# Altium schematic sheet [01]-ESP32.SchDoc
size A3; SheetNumber: 1; SheetTotal: 1
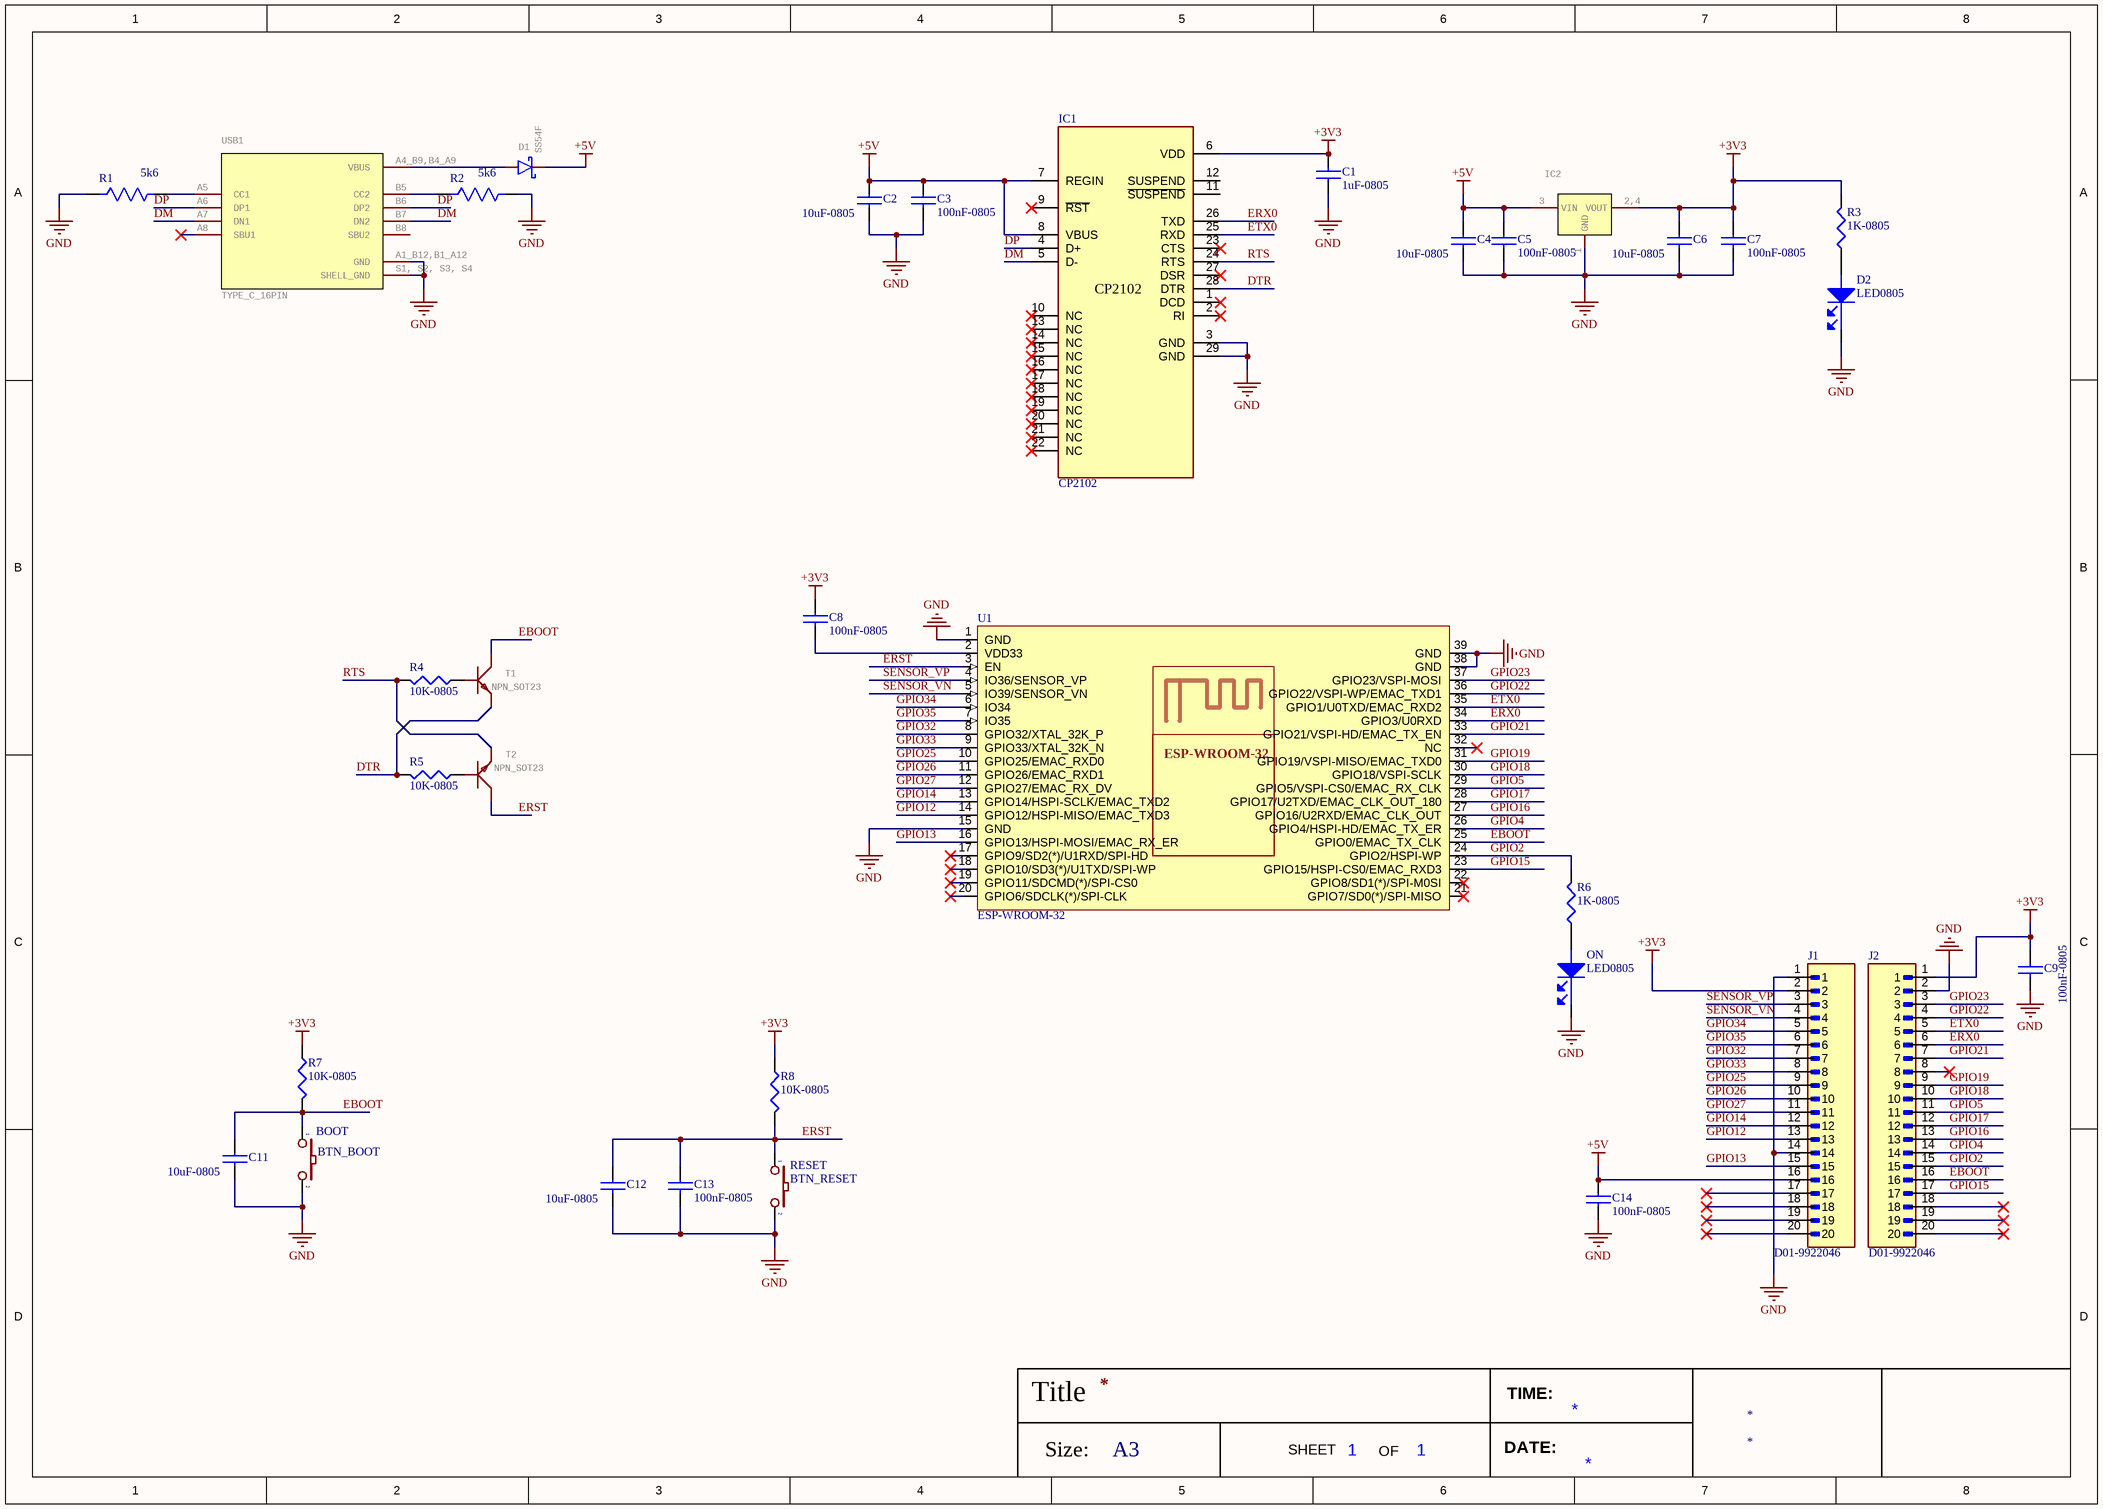
[diagram p0: [01]-ESP32.SchDoc]

## Parts
BOOT  BTN_BOOT  [Button 3x4mm]
C1  1uF-0805  [CAP0805]
C2  10uF-0805  [CAP0805]
C3  100nF-0805  [CAP0805]
C4  10uF-0805  [CAP0805]
C5  100nF-0805  [CAP0805]
C6  10uF-0805  [CAP0805]
C7  100nF-0805  [CAP0805]
C8  100nF-0805  [CAP0805]
C9  100nF-0805  [CAP0805]
C11  10uF-0805  [CAP0805]
C12  10uF-0805  [CAP0805]
C13  100nF-0805  [CAP0805]
C14  100nF-0805  [CAP0805]
D1  SS54F  [SMAF]
D2  LED0805  [LED0805]
IC1  CP2102  [QFN-28]
IC2  LD1117  [SOT223]  (value not drawn)
J1  D01-9922046  [HARWIN_D01-9922046]
J2  D01-9922046  [HARWIN_D01-9922046]
ON  LED0805  [LED0805]
R1  5k6  [R0805]
R2  5k6  [R0805]
R3  1K-0805  [RES0805]
R4  10K-0805  [RES0805]
R5  10K-0805  [RES0805]
R6  1K-0805  [RES0805]
R7  10K-0805  [RES0805]
R8  10K-0805  [RES0805]
RESET  BTN_RESET  [Button 3x4mm]
T1  NPN_SOT23  [SOT23]
T2  NPN_SOT23  [SOT23]
U1  ESP-WROOM-32  [ESP32 WROOM]
USB1  TYPE_C_16PIN  [USB_TYPEC_16PIN]

## Nets
+3V3: C1.2 C6.1 C7.1 C8.1 C9.1 IC1.6(VDD) IC2.2,4(VOUT) J1.2 J2.1 R3.2 R7.1 R8.1
+5V: C2.1 C3.1 C4.1 C5.1 C14.1 D1.C IC1.7(REGIN) IC1.8(VBUS) IC2.3(VIN) J1.16
GND: BOOT.2 C1.1 C2.2 C3.2 C4.2 C5.2 C6.2 C7.2 C9.2 C11.2 C12.2 C13.2 C14.2 D2.1 IC1.3(GND) IC1.29(GND) IC2.1(GND) J1.1 J1.14 J2.2 ON.1 R1.1 R2.2 RESET.2 U1.1(GND) U1.15(GND) U1.38(GND) U1.39(GND) USB1.A1_B12,B1_A12(GND) USB1.S1,_S2,_S3,_S4(SHELL_GND)
DM: IC1.5(D-) USB1.A7(DN1) USB1.B7(DN2)
DP: IC1.4(D+) USB1.A6(DP1) USB1.B6(DP2)
DTR: IC1.28(DTR) R5.2 T1.2(E)
EBOOT: BOOT.1 C11.1 J2.16 R7.2 T1.3(C) U1.25(GPIO0/EMAC_TX_CLK)
ERST: C12.1 C13.1 R8.2 RESET.1 T2.3(C) U1.3(EN)
ERX0: IC1.26(TXD) J2.6 U1.34(GPIO3/U0RXD)
ETX0: IC1.25(RXD) J2.5 U1.35(GPIO1/U0TXD/EMAC_RXD2)
GPIO2: J2.15 R6.2 U1.24(GPIO2/HSPI-WP)
GPIO4: J2.14 U1.26(GPIO4/HSPI-HD/EMAC_TX_ER)
GPIO5: J2.11 U1.29(GPIO5/VSPI-CS0/EMAC_RX_CLK)
GPIO12: J1.13 U1.14(GPIO12/HSPI-MISO/EMAC_TXD3)
GPIO13: J1.15 U1.16(GPIO13/HSPI-MOSI/EMAC_RX_ER)
GPIO14: J1.12 U1.13(GPIO14/HSPI-SCLK/EMAC_TXD2)
GPIO15: J2.17 U1.23(GPIO15/HSPI-CS0/EMAC_RXD3)
GPIO16: J2.13 U1.27(GPIO16/U2RXD/EMAC_CLK_OUT)
GPIO17: J2.12 U1.28(GPIO17/U2TXD/EMAC_CLK_OUT_180)
GPIO18: J2.10 U1.30(GPIO18/VSPI-SCLK)
GPIO19: J2.9 U1.31(GPIO19/VSPI-MISO/EMAC_TXD0)
GPIO21: J2.7 U1.33(GPIO21/VSPI-HD/EMAC_TX_EN)
GPIO22: J2.4 U1.36(GPIO22/VSPI-WP/EMAC_TXD1)
GPIO23: J2.3 U1.37(GPIO23/VSPI-MOSI)
GPIO25: J1.9 U1.10(GPIO25/EMAC_RXD0)
GPIO26: J1.10 U1.11(GPIO26/EMAC_RXD1)
GPIO27: J1.11 U1.12(GPIO27/EMAC_RX_DV)
GPIO32: J1.7 U1.8(GPIO32/XTAL_32K_P)
GPIO33: J1.8 U1.9(GPIO33/XTAL_32K_N)
GPIO34: J1.5 U1.6(IO34)
GPIO35: J1.6 U1.7(IO35)
RTS: IC1.24(RTS) R4.2 T2.2(E)
SENSOR_VN: J1.4 U1.5(IO39/SENSOR_VN)
SENSOR_VP: J1.3 U1.4(IO36/SENSOR_VP)
NetC8_2: C8.2 U1.2(VDD33)
NetD1_A: D1.A USB1.A4_B9,B4_A9(VBUS)
NetD2_2: D2.2 R3.1
NetON_2: ON.2 R6.1
NetR1_2: R1.2 USB1.A5(CC1)
NetR2_1: R2.1 USB1.B5(CC2)
NetR4_1: R4.1 T1.1(B)
NetR5_1: R5.1 T2.1(B)

Not connected (* = marked no-connect by the designer): IC1 1(DCD)* 2(RI)* 9(~{RST})* 10(NC)* 11(~{SUSPEND}) 12(SUSPEND) 13(NC)* 14(NC)* 15(NC)* 16(NC)* 17(NC)* 18(NC)* 19(NC)* 20(NC)* 21(NC)* 22(NC)* 23(CTS)* 27(DSR)*; J1 17* 18* 19* 20*; J2 8* 18* 19* 20*; U1 17(GPIO9/SD2(*)/U1RXD/SPI-HD)* 18(GPIO10/SD3(*)/U1TXD/SPI-WP)* 19(GPIO11/SDCMD(*)/SPI-CS0)* 20(GPIO6/SDCLK(*)/SPI-CLK)* 21(GPIO7/SD0(*)/SPI-MISO)* 22(GPIO8/SD1(*)/SPI-M0SI)* 32(NC)*; USB1 A8(SBU1)* B8(SBU2)

## Notes on the sheet
- Title
- Size:
- A3
- SHEET
- OF
- DATE:
- TIME:

## Library data of the parts
BOOT RESET = SW2_1: Switch button 2 pin; Value: SW chip 2 pin
C1 = CC0805KRX5R7BB105: CAP CER 1UF 16V X5R 0805; Manufacturer: Yageo; Tolerance: ±10%; Notification: Current market demand for these product types have resulted in fluctuating and extending lead times. Lead times may differ.; Supplier 1: Digi-Key; Manufacturer Part Number: CC0805KRX5R7BB105; RoHS: RoHS Compliant; Category: Capacitors; Stock 1: 0; Pricing 1: 4000=0.0422 (USD); Packaging: Tape & Reel (TR); Part Status: Active; Voltage - Rated: 16V; Temperature Coefficient: X5R; Operating Temperature: -55°C ~ 85°C; Features: -; Ratings: -; Applications: General Purpose; Failure Rate: -; Mounting Type: Surface Mount, MLCC; Package / Case: 0805 (2012 Metric); Size / Dimension: 0.079" L x 0.049" W (2.00mm x 1.25mm); Height - Seated (Max): -; Thickness (Max): 0.057" (1.45mm); Lead Spacing: -; Lead Style: -; ComponentLink1URL: http://www.yageo.com/documents/recent/UPY-GPHC_X5R_4V-to-50V_25.pdf; ComponentLink1Description: http://www.yageo.com/documents/recent/UPY-GPHC_X5R_4V-to-50V_25.pdf; Supplier Part Number 1: 311-3427-2-ND
C2-C9 C11-C14 = CC0805KRX7R9BB104: CAP CER 0.1UF 50V X7R 0805; Manufacturer: Yageo; Tolerance: ±10%; Notification: Current market demand for these product types have resulted in fluctuating and extending lead times. Lead times may differ.; Supplier 1: Digi-Key; Manufacturer Part Number: CC0805KRX7R9BB104; RoHS: RoHS Compliant; Category: Capacitors; Stock 1: 0; Pricing 1: 1=0.13, 10=0.093, 100=0.0439, 500=0.03076, 1000=0.02547 (USD); Packaging: Cut Tape (CT); Part Status: Active; Voltage - Rated: 50V; Temperature Coefficient: X7R; Operating Temperature: -55°C ~ 125°C; Features: High Voltage; Ratings: -; Applications: General Purpose; Failure Rate: -; Mounting Type: Surface Mount, MLCC; Package / Case: 0805 (2012 Metric); Size / Dimension: 0.079" L x 0.049" W (2.00mm x 1.25mm); Height - Seated (Max): -; Thickness (Max): 0.033" (0.85mm); Lead Spacing: -; Lead Style: -; ComponentLink1URL: http://www.yageo.com/documents/recent/UPY-GPHC_X7R_6.3V-to-50V_18.pdf; ComponentLink1Description: http://www.yageo.com/documents/recent/UPY-GPHC_X7R_6.3V-to-50V_18.pdf; Supplier Part Number 1: 311-1140-1-ND
D1 = SS54F: GateName_1: G$1; SymbolName_1: DIODE_S; LibraryName: Uy_SMD; DeviceSetName: SS54F; Package: SMAF
D2 ON = LED: LED 0805; Manufacturer: Visual Communications; Manufacturer Part Number: LSM0805452V; Supplier: Digi-Key; Supplier Part Number: 28-LSM0805452VDKR-ND; RoHS: Yes; Category: LEDs; Stock: 55385; Pricing: 1=0.4, 10=0.263, 100=0.1752, 500=0.1212, 1000=0.101 (USD)
IC1 = CP2102: CP2102N USB 2.0 to UART (RS232) Bridge Interface Evaluation Board; MF: Silicon Labs; Purchase-URL: https://pricing.snapeda.com/search/part/CP2102/?ref=eda; Package: WFQFN-20 Silicon Labs; Value: *; Check_prices: https://www.snapeda.com/parts/CP2102/Silicon+Labs/view-part/?ref=eda; SnapEDA_Link: https://www.snapeda.com/parts/CP2102/Silicon+Labs/view-part/?ref=snap; Availability: In Stock; Price: None; MP: CP2102
IC2 = LD1117: GateName_1: G$1; SymbolName_1: AMS1117; LibraryName: Uy_SMD; DeviceSetName: AMS1117; Package: SOT223-3.3
J1 J2 = D01-9922046: 2.54mm (0.1) Pitch SIL Vertical Through Connect Header Strip, tin (hi-temp mould), 20 contacts; MF: Harwin; SnapEDA_Link: https://www.snapeda.com/parts/D01-9922046/Harwin/view-part/?ref=snap; Package: None; Value: *; MP: D01-9922046; Check_prices: https://www.snapeda.com/parts/D01-9922046/Harwin/view-part/?ref=eda
R1 R2 = Resistor 0805: SMD Resistor 0805; Manufacturer: Yageo; Manufacturer Part Number: RC0603FR-071KL; Power Rating: 100mW; Tolerance: 1%; Temperature Coefficient: 100ppm/°C; Voltage Rating: 50V; Supplier: Digi-Key; Supplier Part Number: 311-1.00KHRDKR-ND; RoHS: Yes; Category: Chip SMD Resistors; Stock: 18662657; Pricing: 1=0.1, 10=0.018, 50=0.0106, 100=0.0088, 500=0.00592, 1000=0.00505 (USD); Case/Package: 0603; Case Code (Imperial): 0603; Case Code (Metric): 1608; Contact Plating: Tin,Matte; Min Operating Temperature: -55°C; Max Operating Temperature: 155°C; Packaging: Tape and Reel; Resistor Type: Thick Film; Termination: SMD/SMT; Features: Moisture Resistant; Series: RC; Max Power Dissipation: 100mW; Number of Terminations: 2; Resistance Tolerance: 1%; Construction: Rectangular; Technology: THICK FILM; Length: 1.6mm; Height: 0.45mm; Depth: 0.8mm; Reach SVHC Compliant: No; Military Standard: Not; Lead Free: 5697LeadFree; RoHS Compliant: Yes
R3 R6 = RC0805JR-071KL: RES SMD 1K OHM 5% 1/8W 0805; Manufacturer: Yageo; Power (Watts): 0.125W, 1/8W; Temperature Coefficient: ±100ppm/°C; Supplier 1: Digi-Key; Manufacturer Part Number: RC0805JR-071KL; RoHS: RoHS Compliant; Category: Resistors; Stock 1: 13266; Pricing 1: 1=0.1, 10=0.036, 100=0.0145, 1000=0.00652, 2500=0.00566 (USD); Packaging: Cut Tape (CT); Part Status: Active; Tolerance: ±5%; Composition: Thick Film; Features: Moisture Resistant; Operating Temperature: -55°C ~ 155°C; Package / Case: 0805 (2012 Metric); Supplier Device Package: 0805; Size / Dimension: 0.079" L x 0.049" W (2.00mm x 1.25mm); Height - Seated (Max): 0.024" (0.60mm); Failure Rate: -; ComponentLink1URL: http://www.yageo.com/documents/recent/PYu-RC_Group_51_RoHS_L_9.pdf; ComponentLink1Description: http://www.yageo.com/documents/recent/PYu-RC_Group_51_RoHS_L_9.pdf; Supplier Part Number 1: 311-1.0KARCT-ND
R4 R5 R7 R8 = RC0805JR-0710KL: RES SMD 10K OHM 5% 1/8W 0805; Manufacturer: Yageo; Power (Watts): 0.125W, 1/8W; Temperature Coefficient: ±100ppm/°C; Supplier 1: Digi-Key; Manufacturer Part Number: RC0805JR-0710KL; RoHS: RoHS Compliant; Category: Resistors; Stock 1: 0; Pricing 1: 1=0.1, 10=0.036, 100=0.0145, 1000=0.00652, 2500=0.00566 (USD); Packaging: Cut Tape (CT); Part Status: Active; Tolerance: ±5%; Composition: Thick Film; Features: Moisture Resistant; Operating Temperature: -55°C ~ 155°C; Package / Case: 0805 (2012 Metric); Supplier Device Package: 0805; Size / Dimension: 0.079" L x 0.049" W (2.00mm x 1.25mm); Height - Seated (Max): 0.024" (0.60mm); Failure Rate: -; ComponentLink1URL: http://www.yageo.com/documents/recent/PYu-RC_Group_51_RoHS_L_9.pdf; ComponentLink1Description: http://www.yageo.com/documents/recent/PYu-RC_Group_51_RoHS_L_9.pdf; Supplier Part Number 1: 311-10KARCT-ND
T1 T2 = NPN_SOT23: BJT SOT23; GateName_1: G$1; SymbolName_1: NPN; LibraryName: Uy_SMD; DeviceSetName: NPN; Package: SOT23(1)
USB1 = TYPE_C_16PIN: GateName_1: G$1; SymbolName_1: USB4105-GF-A; DeviceSetName: TYPE_C_FEMALE; MF: GCT; LibraryName: Uy_SMD; Package: GCT_USB4105-GF-A; AVAILABILITY: Warning; MP: USB4105-GF-A; PACKAGE: None; PRICE: None